# EasyEDA schematic TactJam_Assembly.json
TITLE: TactJam DevBoard; REV: 1.0; Date: 2020-11-18; Sheet: 1/1; Company: -
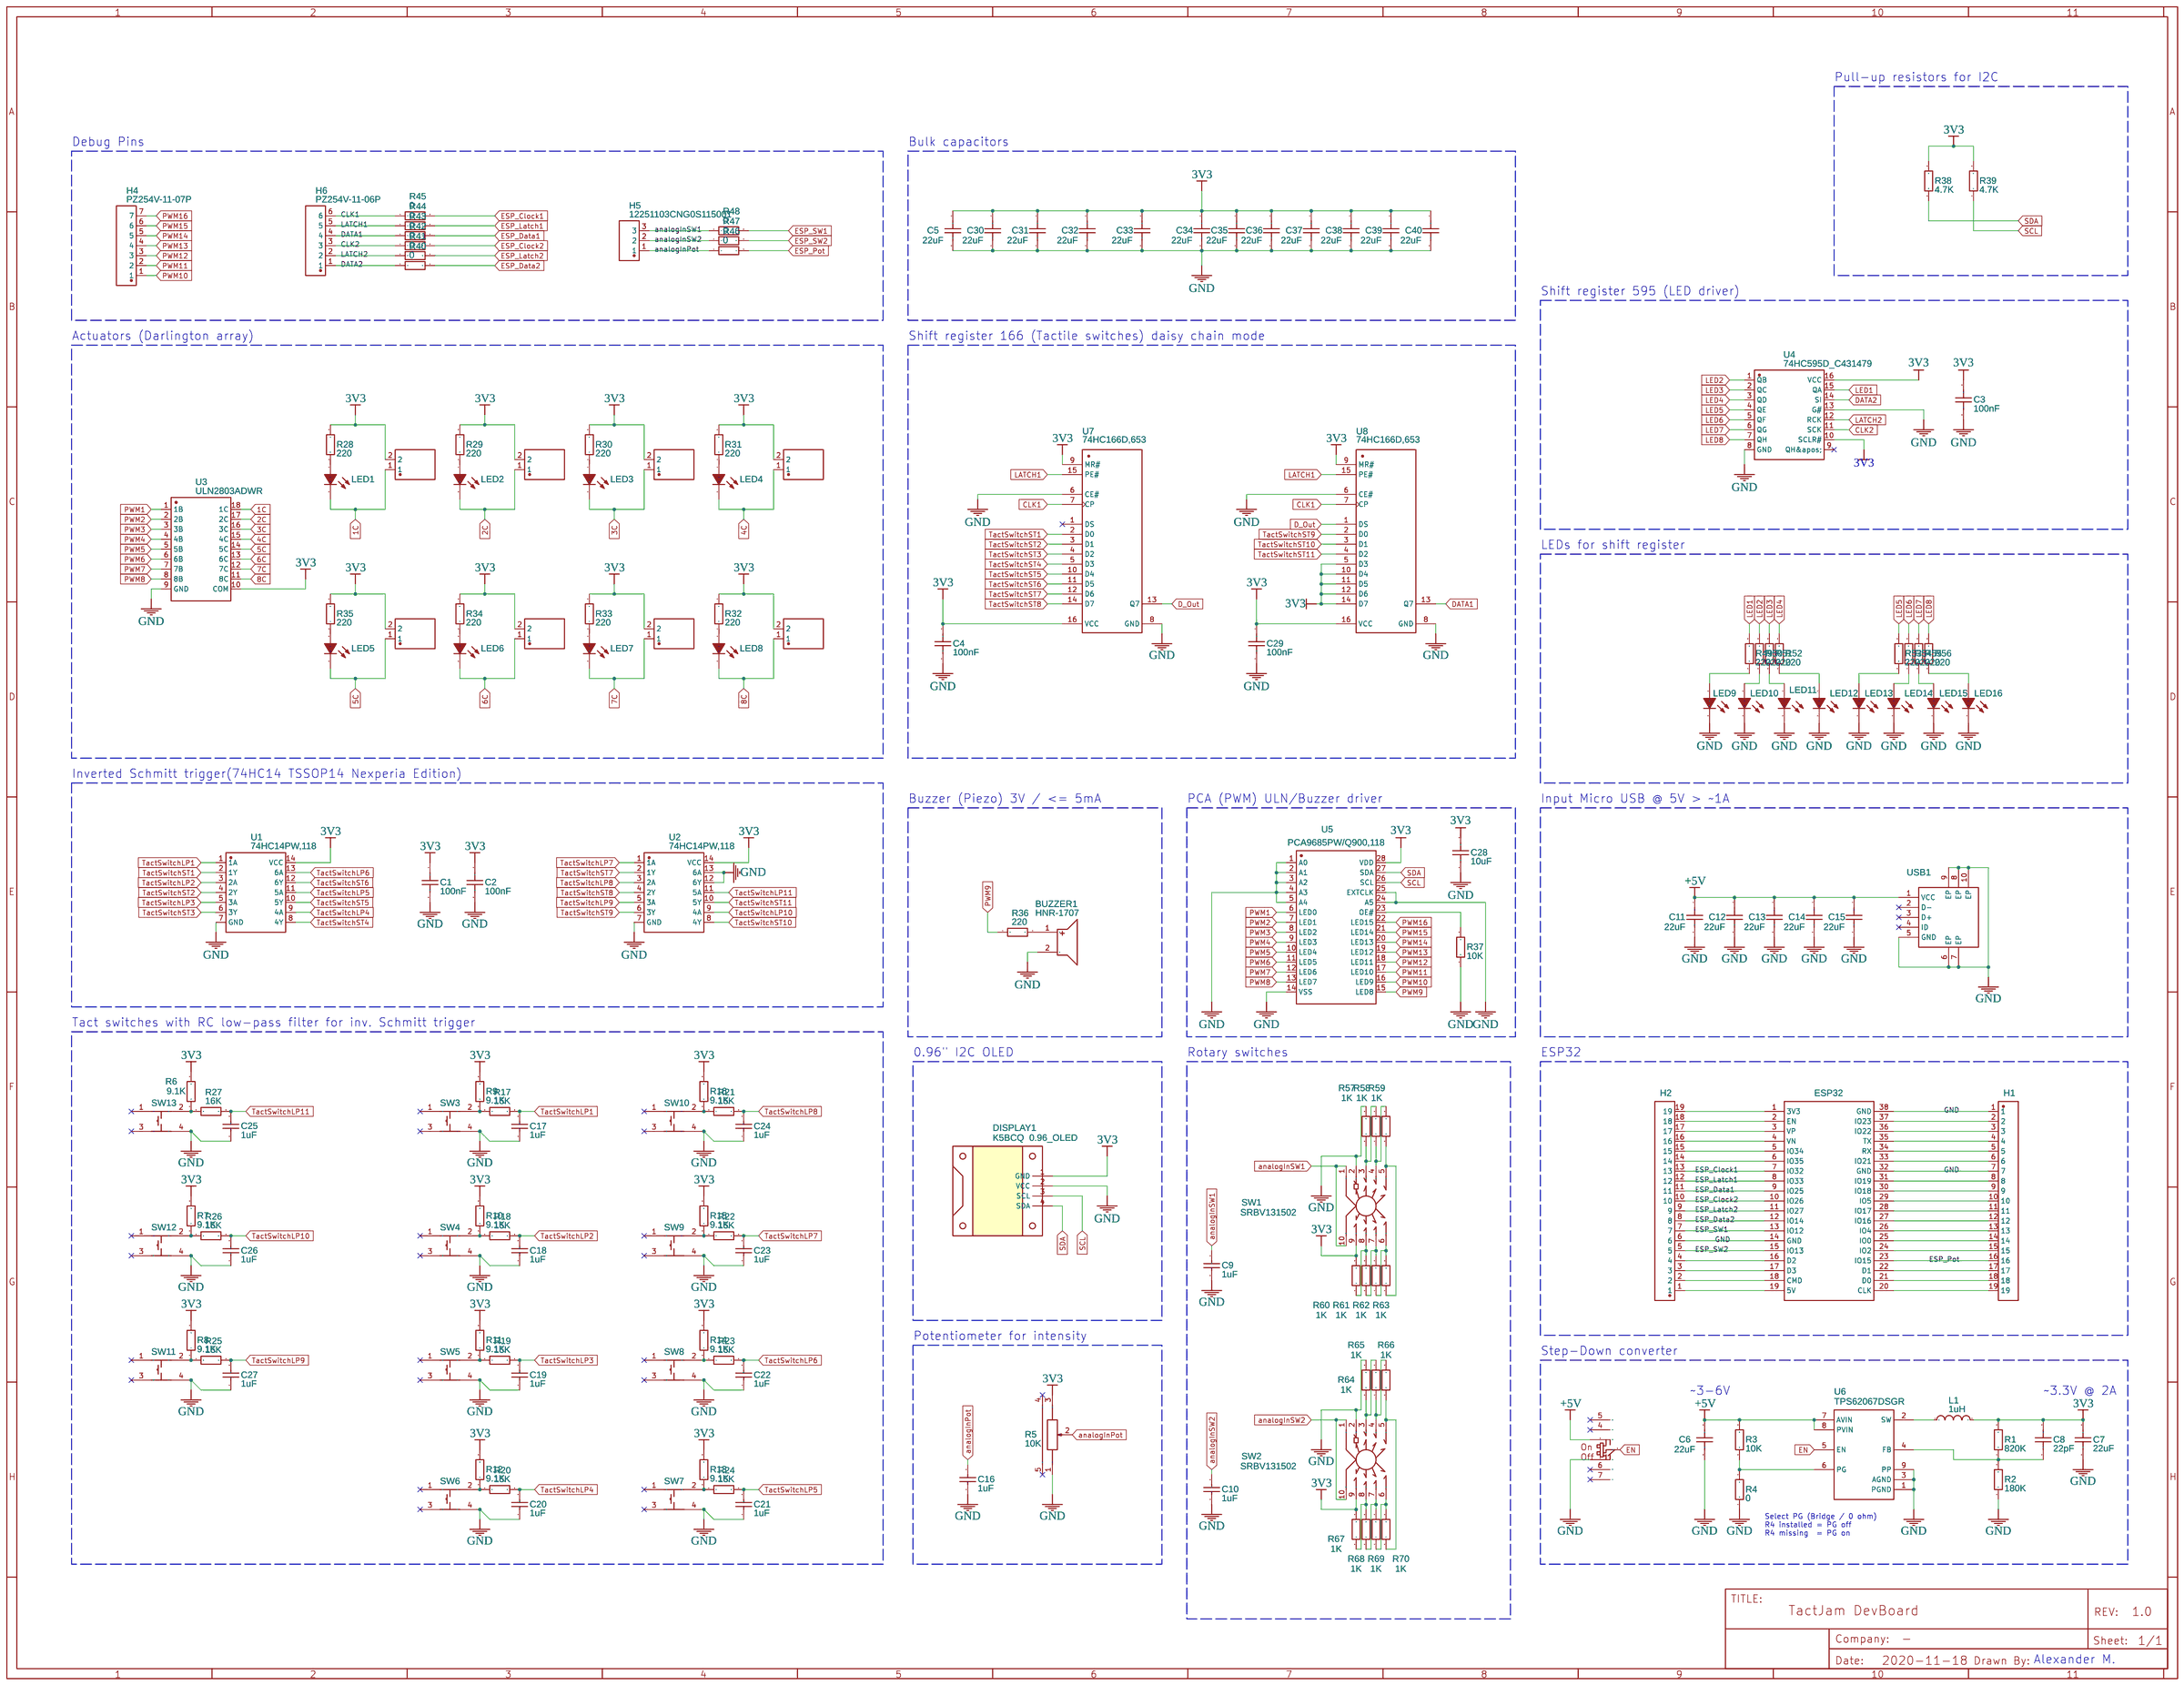
[diagram p0: schematic sheet]

## Parts
BUZZER1  HNR-1707  [BUZ-TH_BD17.0-P10.00-D0.9]
C1  100nF  [C0402]
C2  100nF  [C0402]
C3  100nF  [C0402]
C4  100nF  [C0402]
C5  22uF  [C0603]
C6  22uF  [C0603]
C7  22uF  [C0603]
C8  22pF  [C0402]
C9  1uF  [C0603]
C10  1uF  [C0603]
C11  22uF  [C0603]
C12  22uF  [C0603]
C13  22uF  [C0603]
C14  22uF  [C0603]
C15  22uF  [C0603]
C16  1uF  [C0603]
C17  1uF  [C0603]
C18  1uF  [C0603]
C19  1uF  [C0603]
C20  1uF  [C0603]
C21  1uF  [C0603]
C22  1uF  [C0603]
C23  1uF  [C0603]
C24  1uF  [C0603]
C25  1uF  [C0603]
C26  1uF  [C0603]
C27  1uF  [C0603]
C28  10uF  [C0603]
C29  100nF  [C0402]
C30  22uF  [C0603]
C31  22uF  [C0603]
C32  22uF  [C0603]
C33  22uF  [C0603]
C34  22uF  [C0603]
C35  22uF  [C0603]
C36  22uF  [C0603]
C37  22uF  [C0603]
C38  22uF  [C0603]
C39  22uF  [C0603]
C40  22uF  [C0603]
CONNECTOR1  Connector  [CONN-TH_2P-P2.54_2501S-2P]
CONNECTOR2  Connector  [CONN-TH_2P-P2.54_2501S-2P]
CONNECTOR3  Connector  [CONN-TH_2P-P2.54_2501S-2P]
CONNECTOR4  Connector  [CONN-TH_2P-P2.54_2501S-2P]
CONNECTOR5  Connector  [CONN-TH_2P-P2.54_2501S-2P]
CONNECTOR6  Connector  [CONN-TH_2P-P2.54_2501S-2P]
CONNECTOR7  Connector  [CONN-TH_2P-P2.54_2501S-2P]
CONNECTOR8  Connector  [CONN-TH_2P-P2.54_2501S-2P]
DISPLAY1  K5BCQ  0.96_OLED  [0.96 OLED]
ESP1  ESP32  [ESP32 MODULE]
H1  C247840  [HDR-TH_19P-P2.54-H-W10.5]
H2  C247840  [HDR-TH_19P-P2.54-H-W10.5]
H4  PZ254V-11-07P  [HDR-TH_7P-P2.54-V-M]
H5  12251103CNG0S115001  [HDR-TH_3P-P2.54-V]
H6  PZ254V-11-06P  [HDR-TH_6P-P2.54-V-M]
L1  1uH  [IND-SMD_L4.0-W4.0]
LED1  19-217/GHC-YR1S2/3T  [LED0603-R-RD]
LED2  19-217/GHC-YR1S2/3T  [LED0603-R-RD]
LED3  19-217/GHC-YR1S2/3T  [LED0603-R-RD]
LED4  19-217/GHC-YR1S2/3T  [LED0603-R-RD]
LED5  19-217/GHC-YR1S2/3T  [LED0603-R-RD]
LED6  19-217/GHC-YR1S2/3T  [LED0603-R-RD]
LED7  19-217/GHC-YR1S2/3T  [LED0603-R-RD]
LED8  19-217/GHC-YR1S2/3T  [LED0603-R-RD]
LED9  19-217/GHC-YR1S2/3T  [LED0603-R-RD]
LED10  19-217/GHC-YR1S2/3T  [LED0603-R-RD]
LED11  19-217/GHC-YR1S2/3T  [LED0603-R-RD]
LED12  19-217/GHC-YR1S2/3T  [LED0603-R-RD]
LED13  19-217/GHC-YR1S2/3T  [LED0603-R-RD]
LED14  19-217/GHC-YR1S2/3T  [LED0603-R-RD]
LED15  19-217/GHC-YR1S2/3T  [LED0603-R-RD]
LED16  19-217/GHC-YR1S2/3T  [LED0603-R-RD]
R1  820K  [R0603]
R2  180K  [R0603]
R3  10K  [R0603]
R4  0  [R0603]
R5  10K  [RES-TH_RK09K1130A5R]
R6  9.1K  [R0603]
R7  9.1K  [R0603]
R8  9.1K  [R0603]
R9  9.1K  [R0603]
R10  9.1K  [R0603]
R11  9.1K  [R0603]
R12  9.1K  [R0603]
R13  9.1K  [R0603]
R14  9.1K  [R0603]
R15  9.1K  [R0603]
R16  9.1K  [R0603]
R17  16K  [R0603]
R18  16K  [R0603]
R19  16K  [R0603]
R20  16K  [R0603]
R21  16K  [R0603]
R22  16K  [R0603]
R23  16K  [R0603]
R24  16K  [R0603]
R25  16K  [R0603]
R26  16K  [R0603]
R27  16K  [R0603]
R28  220  [R0603]
R29  220  [R0603]
R30  220  [R0603]
R31  220  [R0603]
R32  220  [R0603]
R33  220  [R0603]
R34  220  [R0603]
R35  220  [R0603]
R36  220  [R0603]
R37  10K  [R0603]
R38  4.7K  [R0603]
R39  4.7K  [R0603]
R40  0  [R0603]
R41  0  [R0603]
R42  0  [R0603]
R43  0  [R0603]
R44  0  [R0603]
R45  0  [R0603]
R46  0  [R0603]
R47  0  [R0603]
R48  0  [R0603]
R49  220  [R0603]
R50  220  [R0603]
R51  220  [R0603]
R52  220  [R0603]
R53  220  [R0603]
R54  220  [R0603]
R55  220  [R0603]
R56  220  [R0603]
R57  1K  [R0603]
R58  1K  [R0603]
R59  1K  [R0603]
R60  1K  [R0603]
R61  1K  [R0603]
R62  1K  [R0603]
R63  1K  [R0603]
R64  1K  [R0603]
R65  1K  [R0603]
R66  1K  [R0603]
R67  1K  [R0603]
R68  1K  [R0603]
R69  1K  [R0603]
R70  1K  [R0603]
SW1  SRBV131502  [SW-TH_SRBV131502]
SW2  SRBV131502  [SW-TH_SRBV131502]
SW3  TS-1003T-26  [SW-TH_4P-L12.0-W12.0-P5.00-LS12.5]
SW4  TS-1003T-26  [SW-TH_4P-L12.0-W12.0-P5.00-LS12.5]
SW5  TS-1003T-26  [SW-TH_4P-L12.0-W12.0-P5.00-LS12.5]
SW6  TS-1003T-26  [SW-TH_4P-L12.0-W12.0-P5.00-LS12.5]
SW7  TS-1003T-26  [SW-TH_4P-L12.0-W12.0-P5.00-LS12.5]
SW8  TS-1003T-26  [SW-TH_4P-L12.0-W12.0-P5.00-LS12.5]
SW9  TS-1003T-26  [SW-TH_4P-L12.0-W12.0-P5.00-LS12.5]
SW10  TS-1003T-26  [SW-TH_4P-L12.0-W12.0-P5.00-LS12.5]
SW11  TS-1003T-26  [SW-TH_4P-L12.0-W12.0-P5.00-LS12.5]
SW12  TS-1003T-26  [SW-TH_4P-L12.0-W12.0-P5.00-LS12.5]
SW13  TS-1003T-26  [SW-TH_4P-L12.0-W12.0-P5.00-LS12.5]
SWSTEP1  K3-1296S-E1  [SW-TH_K3-1296S-E1]
U1  74HC14PW,118  [TSSOP-14_L5.0-W4.4-P0.65-LS6.4-BL]
U2  74HC14PW,118  [TSSOP-14_L5.0-W4.4-P0.65-LS6.4-BL]
U3  ULN2803ADWR  [SOIC-18_L11.6-W7.5-P1.27-LS10.3-BL]
U4  74HC595D_C431479  [SOIC-16_L9.9-W3.9-P1.27-LS6.0-BL]
U5  PCA9685PW/Q900,118  [TSSOP-28_L9.7-W4.4-P0.65-LS6.4-BL]
U6  TPS62067DSGR  [WSON-8_L2.0-W2.0-P0.50-BL-EP_TPS259571DSGR]
U7  74HC166D,653  [SOIC-16_L10.8-W4.5-P1.27-LS6.8-BL]
U8  74HC166D,653  [SOIC-16_L10.8-W4.5-P1.27-LS6.8-BL]
USB1  105017-0001  [MICRO-USB-SMD_105017-0001]

## Library data of the parts
BUZZER1 = HNR-1707: Supplier: LCSC; Manufacturer: HNDZ; Contributor: LCSC; Supplier Part: C129400
C1-C4 C29 = CL05B104KB54PNC: Supplier: LCSC; Supplier Part: C307331; Manufacturer: Samsung Electro-Mechanics; Contributor: LCSC; LCSC Assembly: Yes; SMT Type: Extend
C5-C7 C11-C15 C30-C40 = CL10A226MQ8NRNC: Supplier: LCSC; Manufacturer: SAMSUNG; LCSC Assembly: Yes; Supplier Part: C59461; SMT Type: Basic
C8 = CL05C220JB5NNNC: Supplier: LCSC; Manufacturer: SAMSUNG; Supplier Part: C70464; LCSC Assembly: Yes; SMT Type: Extend
C9 C10 C16-C27 = CL10B105KA8NNNC: Supplier: LCSC; Manufacturer: SAMSUNG; Supplier Part: C29936; LCSC Assembly: Yes; SMT Type: Extend
C28 = CL10A106MA8NRNC: Supplier: LCSC; Manufacturer: SAMSUNG; Supplier Part: C96446; LCSC Assembly: Yes; SMT Type: Extend
CONNECTOR1 CONNECTOR3-CONNECTOR8 = 2501SB-2P: Supplier: LCSC; Supplier Part: C132463; Manufacturer: Shenzhen Cankemeng; Contributor: LCSC
CONNECTOR2 = 2501SB-2P: Supplier: LCSC; Supplier Part: C63855; Manufacturer: Shenzhen Cankemeng; Contributor: LCSC
DISPLAY1 = K5BCQ  0.96_OLED: Contributor: Kookavitch
ESP1 = ESP32: Contributor: changzi.LU
H1 H2 = C247840: Supplier: LCSC; Manufacturer: Boom Precision Elec; Contributor: LCSC
H4 = PZ254V-11-07P: Supplier: LCSC; Supplier Part: C492406; Manufacturer: XFCN; Contributor: LCSC
H5 = 12251103CNG0S115001: Supplier: LCSC; Supplier Part: C429954; Manufacturer: JILN; Contributor: LCSC
H6 = PZ254V-11-06P: Supplier: LCSC; Supplier Part: C492405; Manufacturer: XFCN; Contributor: LCSC
L1 = LQH44PN1R0NP0L: Supplier: LCSC; Manufacturer: MuRata; Supplier Part: C98026
LED1-LED16 = 19-217/GHC-YR1S2/3T: Supplier: LCSC; Manufacturer: EVERLIGHT; image: //image.lceda.cn/szlcsc/C72043.jpg; Supplier Part: C72043; SMT Type: Basic; JLCPCB SMD: Yes
R1 = TC0325B8203T5E: Supplier: LCSC; Manufacturer: UniOhm; Supplier Part: C53198; LCSC Assembly: Yes; SMT Type: Extend
R2 = 0603WAF1803T5E: Supplier: LCSC; Manufacturer: UniOhm; LCSC Assembly: Yes; Supplier Part: C22827; SMT Type: Basic
R3 R37 = 0603WAF1002T5E: Supplier: LCSC; Manufacturer: UniOhm; LCSC Assembly: Yes; Supplier Part: C25804; SMT Type: Basic
R4 R40-R48 = 0603WAF0000T5E: Supplier: LCSC; Manufacturer: UniOhm; Supplier Part: C21189; SMT Type: Basic; JLCPCB SMD: Yes
R5 = RK09K1130A5R: Supplier: LCSC; Supplier Part: C209779; Manufacturer: ALPS Electric; Contributor: LCSC
R6-R16 = TC0350D9101T5E: Supplier: LCSC; Manufacturer: UniOhm; Supplier Part: C98730; LCSC Assembly: Yes; SMT Type: Extend
R17-R27 = TC0325B1602T5E: Supplier: LCSC; Manufacturer: UniOhm; Contributor: LCSC; Supplier Part: C139125; LCSC Assembly: Yes; SMT Type: Extend
R28-R36 R49-R56 = 0603WAF2200T5E: Supplier: LCSC; Manufacturer: UniOhm; Supplier Part: C22962; SMT Type: Basic; JLCPCB SMD: Yes
R38 R39 = 0603WAF4701T5E: Supplier: LCSC; Manufacturer: UniOhm; Supplier Part: C23162; SMT Type: Basic; JLCPCB SMD: Yes
R57-R70 = 0603WAF1001T5E: Supplier: LCSC; Manufacturer: UniOhm; Supplier Part: C21190; SMT Type: Basic; JLCPCB SMD: Yes
SW1 SW2 = SRBV131502: Supplier: LCSC; Supplier Part: C255511; Manufacturer: ALPS Electric; Contributor: LCSC
SW3-SW13 = TS-1003T-26: Supplier: LCSC; Supplier Part: C455235; Manufacturer: XUNPU; Contributor: LCSC
SWSTEP1 = K3-1296S-E1: Supplier: LCSC; Manufacturer: HRO; Contributor: LCSC; Supplier Part: C128955
U1 U2 = 74HC14PW,118: Supplier: LCSC; Manufacturer: Nexperia; image: //image.lceda.cn/szlcsc/C5606.jpg; Supplier Part: C5606; LCSC Assembly: Yes; SMT Type: Extend
U3 = ULN2803ADWR: Supplier: LCSC; Manufacturer: TI; LCSC Assembly: Yes; image: //image.lceda.cn/szlcsc/C9683.jpg; Supplier Part: C9683; SMT Type: Basic
U4 = 74HC595D_C431479: Supplier: LCSC; Supplier Part: C431479; Manufacturer: TOSHIBA; Manufacturer Part: 74HC595D; Contributor: LCSC; LCSC Assembly: Yes; SMT Type: Extend
U5 = PCA9685PW/Q900,118: Supplier: LCSC; Manufacturer: NXP; Supplier Part: C92206; LCSC Assembly: Yes; SMT Type: Extend
U6 = TPS62067DSGR: Supplier: LCSC; Manufacturer: TI; image: //image.lceda.cn/szlcsc/C7098.jpg; Supplier Part: C7098; LCSC Assembly: Yes; SMT Type: Extend
U7 U8 = 74HC166D,653: Supplier: LCSC; Manufacturer: Nexperia; Supplier Part: C131891; LCSC Assembly: Yes; SMT Type: Extend
USB1 = 105017-0001: Supplier: LCSC; Manufacturer: MOLEX; Contributor: LCSC; Supplier Part: C136000

## Nets
3V3: C1.1 C2.1 C3.1 C4.1 C5.1 C7.2 C8.2 C28.2 C29.1 C30.1 C31.1 C32.1 C33.1 C34.1 C35.1 C36.1 C37.1 C38.1 C39.1 C40.1 CONNECTOR1.2 CONNECTOR2.2 CONNECTOR3.2 CONNECTOR4.2 CONNECTOR5.2 CONNECTOR6.2 CONNECTOR7.2 CONNECTOR8.2 DISPLAY1.1(GND) L1.2 R1.2 R5.3 R6.2 R7.2 R8.2 R9.2 R10.2 R11.2 R12.2 R13.2 R14.2 R15.2 R16.2 R28.2 R29.2 R30.2 R31.2 R32.2 R33.2 R34.2 R35.2 R38.2 R39.2 R60.2 R67.2 SW1.9 SW2.9 U1.14(VCC) U2.14(VCC) U3.10(COM) U4.10(SCLR#) U4.16(VCC) U5.28(VDD) U7.9(MR#) U7.16(VCC) U8.5(D3) U8.9(MR#) U8.10(D4) U8.11(D5) U8.12(D6) U8.14(D7) U8.16(VCC)
+5V: C6.1 C11.1 C12.1 C13.1 C14.1 C15.1 R3.2 SWSTEP1.3 U6.7(AVIN) U6.8(PVIN) USB1.1(VCC)
GND: BUZZER1.2 C1.2 C2.2 C3.2 C4.2 C5.2 C6.2 C7.1 C9.1 C10.1 C11.2 C12.2 C13.2 C14.2 C15.2 C16.1 C17.1 C18.1 C19.1 C20.1 C21.1 C22.1 C23.1 C24.1 C25.1 C26.1 C27.1 C28.1 C29.2 C30.2 C31.2 C32.2 C33.2 C34.2 C35.2 C36.2 C37.2 C38.2 C39.2 C40.2 DISPLAY1.2(VCC) ESP1.14(GND) ESP1.32(GND) ESP1.38(GND) H1.1 H1.7 H2.6 LED9.2(C) LED10.2(C) LED11.2(C) LED12.2(C) LED13.2(C) LED14.2(C) LED15.2(C) LED16.2(C) R2.1 R4.1 R5.1 R37.1 R57.2 R64.2 SW1.2 SW2.2 SW3.4 SW4.4 SW5.4 SW6.4 SW7.4 SW8.4 SW9.4 SW10.4 SW11.4 SW12.4 SW13.4 SWSTEP1.1 U1.7(GND) U2.7(GND) U2.12(6Y) U2.13(6A) U3.9(GND) U4.8(GND) U4.13(G#) U5.1(A0) U5.2(A1) U5.3(A2) U5.4(A3) U5.5(A4) U5.14(VSS) U5.24(A5) U5.25(EXTCLK) U6.1(PGND) U6.3(AGND) U6.9(PP) U7.6(CE#) U7.8(GND) U8.6(CE#) U8.8(GND) USB1.5(GND) USB1.6(EP) USB1.7(EP) USB1.8(EP) USB1.9(EP) USB1.10(EP)
1C: CONNECTOR1.1 LED1.2(C) U3.18(1C)
2C: CONNECTOR2.1 LED2.2(C) U3.17(2C)
3C: CONNECTOR3.1 LED3.2(C) U3.16(3C)
4C: CONNECTOR4.1 LED4.2(C) U3.15(4C)
5C: CONNECTOR5.1 LED5.2(C) U3.14(5C)
6C: CONNECTOR6.1 LED6.2(C) U3.13(6C)
7C: CONNECTOR7.1 LED7.2(C) U3.12(7C)
8C: CONNECTOR8.1 LED8.2(C) U3.11(8C)
analogInPot: C16.2 H5.1 R5.2 R46.1
analogInSW1: C9.2 H5.3 R48.1 SW1.1 SW1.10
analogInSW2: C10.2 H5.2 R47.1 SW2.1 SW2.10
CLK1: H6.6 R45.1 U7.7(CP) U8.7(CP)
CLK2: H6.3 R42.1 U4.11(SCK)
D_Out: U7.13(Q7) U8.1(DS)
DATA1: H6.4 R43.1 U8.13(Q7)
DATA2: H6.1 R40.1 U4.14(SI)
EN: SWSTEP1.2 U6.5(EN)
ESP_Clock1: ESP1.7(IO32) H2.13 R45.2
ESP_Clock2: ESP1.10(IO26) H2.10 R42.2
ESP_Data1: ESP1.9(IO25) H2.11 R43.2
ESP_Data2: ESP1.12(IO14) H2.8 R40.2
ESP_Latch1: ESP1.8(IO33) H2.12 R44.2
ESP_Latch2: ESP1.11(IO27) H2.9 R41.2
ESP_Pot: ESP1.23(IO15) H1.16 R46.2
ESP_SW1: ESP1.13(IO12) H2.7 R48.2
ESP_SW2: ESP1.15(IO13) H2.5 R47.2
LATCH1: H6.5 R44.1 U7.15(PE#) U8.15(PE#)
LATCH2: H6.2 R41.1 U4.12(RCK)
LED1: R49.2 U4.15(QA)
LED2: R50.2 U4.1(QB)
LED3: R51.2 U4.2(QC)
LED4: R52.2 U4.3(QD)
LED5: R53.2 U4.4(QE)
LED6: R54.2 U4.5(QF)
LED7: R55.2 U4.6(QG)
LED8: R56.2 U4.7(QH)
PWM1: U3.1(1B) U5.6(LED0)
PWM2: U3.2(2B) U5.7(LED1)
PWM3: U3.3(3B) U5.8(LED2)
PWM4: U3.4(4B) U5.9(LED3)
PWM5: U3.5(5B) U5.10(LED4)
PWM6: U3.6(6B) U5.11(LED5)
PWM7: U3.7(7B) U5.12(LED6)
PWM8: U3.8(8B) U5.13(LED7)
PWM9: R36.1 U5.15(LED8)
PWM10: H4.1 U5.16(LED9)
PWM11: H4.2 U5.17(LED10)
PWM12: H4.3 U5.18(LED11)
PWM13: H4.4 U5.19(LED12)
PWM14: H4.5 U5.20(LED13)
PWM15: H4.6 U5.21(LED14)
PWM16: H4.7 U5.22(LED15)
SCL: DISPLAY1.3(SCL) R39.1 U5.26(SCL)
SDA: DISPLAY1.4(SDA) R38.1 U5.27(SDA)
TactSwitchLP1: C17.2 R17.2 U1.1(1A)
TactSwitchLP2: C18.2 R18.2 U1.3(2A)
TactSwitchLP3: C19.2 R19.2 U1.5(3A)
TactSwitchLP4: C20.2 R20.2 U1.9(4A)
TactSwitchLP5: C21.2 R24.2 U1.11(5A)
TactSwitchLP6: C22.2 R23.2 U1.13(6A)
TactSwitchLP7: C23.2 R22.2 U2.1(1A)
TactSwitchLP8: C24.2 R21.2 U2.3(2A)
TactSwitchLP9: C27.2 R25.2 U2.5(3A)
TactSwitchLP10: C26.2 R26.2 U2.9(4A)
TactSwitchLP11: C25.2 R27.2 U2.11(5A)
TactSwitchST1: U1.2(1Y) U7.2(D0)
TactSwitchST2: U1.4(2Y) U7.3(D1)
TactSwitchST3: U1.6(3Y) U7.4(D2)
TactSwitchST4: U1.8(4Y) U7.5(D3)
TactSwitchST5: U1.10(5Y) U7.10(D4)
TactSwitchST6: U1.12(6Y) U7.11(D5)
TactSwitchST7: U2.2(1Y) U7.12(D6)
TactSwitchST8: U2.4(2Y) U7.14(D7)
TactSwitchST9: U2.6(3Y) U8.2(D0)
TactSwitchST10: U2.8(4Y) U8.3(D1)
TactSwitchST11: U2.10(5Y) U8.4(D2)
Net-(BUZZER1-1): BUZZER1.1 R36.2
Net-(C8-1): C8.1 R1.1 R2.2 U6.4(FB)
Net-(ESP1-1): ESP1.1(3V3) H2.19
Net-(ESP1-2): ESP1.2(EN) H2.18
Net-(ESP1-3): ESP1.3(VP) H2.17
Net-(ESP1-4): ESP1.4(VN) H2.16
Net-(ESP1-5): ESP1.5(IO34) H2.15
Net-(ESP1-6): ESP1.6(IO35) H2.14
Net-(ESP1-16): ESP1.16(D2) H2.4
Net-(ESP1-17): ESP1.17(D3) H2.3
Net-(ESP1-18): ESP1.18(CMD) H2.2
Net-(ESP1-19): ESP1.19(5V) H2.1
Net-(ESP1-20): ESP1.20(CLK) H1.19
Net-(ESP1-21): ESP1.21(D0) H1.18
Net-(ESP1-22): ESP1.22(D1) H1.17
Net-(ESP1-24): ESP1.24(IO2) H1.15
Net-(ESP1-25): ESP1.25(IO0) H1.14
Net-(ESP1-26): ESP1.26(IO4) H1.13
Net-(ESP1-27): ESP1.27(IO16) H1.12
Net-(ESP1-28): ESP1.28(IO17) H1.11
Net-(ESP1-29): ESP1.29(IO5) H1.10
Net-(ESP1-30): ESP1.30(IO18) H1.9
Net-(ESP1-31): ESP1.31(IO19) H1.8
Net-(ESP1-33): ESP1.33(IO21) H1.6
Net-(ESP1-34): ESP1.34(RX) H1.5
Net-(ESP1-35): ESP1.35(TX) H1.4
Net-(ESP1-36): ESP1.36(IO22) H1.3
Net-(ESP1-37): ESP1.37(IO23) H1.2
Net-(L1-1): L1.1 U6.2(SW)
Net-(LED1-1): LED1.1(A) R28.1
Net-(LED2-1): LED2.1(A) R29.1
Net-(LED3-1): LED3.1(A) R30.1
Net-(LED4-1): LED4.1(A) R31.1
Net-(LED5-1): LED5.1(A) R35.1
Net-(LED6-1): LED6.1(A) R34.1
Net-(LED7-1): LED7.1(A) R33.1
Net-(LED8-1): LED8.1(A) R32.1
Net-(LED9-1): LED9.1(A) R49.1
Net-(LED10-1): LED10.1(A) R50.1
Net-(LED11-1): LED11.1(A) R51.1
Net-(LED12-1): LED12.1(A) R52.1
Net-(LED13-1): LED13.1(A) R53.1
Net-(LED14-1): LED14.1(A) R54.1
Net-(LED15-1): LED15.1(A) R55.1
Net-(LED16-1): LED16.1(A) R56.1
Net-(R3-1): R3.1 R4.2 U6.6(PG)
Net-(R6-1): R6.1 R27.1 SW13.2
Net-(R7-1): R7.1 R26.1 SW12.2
Net-(R8-1): R8.1 R25.1 SW11.2
Net-(R9-1): R9.1 R17.1 SW3.2
Net-(R10-1): R10.1 R18.1 SW4.2
Net-(R11-1): R11.1 R19.1 SW5.2
Net-(R12-1): R12.1 R20.1 SW6.2
Net-(R13-1): R13.1 R24.1 SW7.2
Net-(R14-1): R14.1 R23.1 SW8.2
Net-(R15-1): R15.1 R22.1 SW9.2
Net-(R16-1): R16.1 R21.1 SW10.2
Net-(R37-2): R37.2 U5.23(OE#)
Net-(R57-1): R57.1 R58.2 SW1.3
Net-(R58-1): R58.1 R59.2 SW1.4
Net-(R59-1): R59.1 R63.1 SW1.5
Net-(R60-1): R60.1 R61.2 SW1.8
Net-(R61-1): R61.1 R62.2 SW1.7
Net-(R62-1): R62.1 R63.2 SW1.6
Net-(R64-1): R64.1 R65.2 SW2.3
Net-(R65-1): R65.1 R66.2 SW2.4
Net-(R66-1): R66.1 R70.1 SW2.5
Net-(R67-1): R67.1 R68.2 SW2.8
Net-(R68-1): R68.1 R69.2 SW2.7
Net-(R69-1): R69.1 R70.2 SW2.6

Not connected (* = marked no-connect by the designer): R5 4(EH)* 5(EH)*; SW3 1* 3*; SW4 1* 3*; SW5 1* 3*; SW6 1* 3*; SW7 1* 3*; SW8 1* 3*; SW9 1* 3*; SW10 1* 3*; SW11 1* 3*; SW12 1* 3*; SW13 1* 3*; SWSTEP1 4* 5* 6* 7*; U4 9(QH')*; U7 1(DS)*; USB1 2(D-)* 3(D+)* 4(ID)*

## Notes on the sheet
- Pull-up resistors for I2C
- Debug Pins
- Bulk capacitors
- Shift register 595 (LED driver)
- Actuators (Darlington array)
- Shift register 166 (Tactile switches) daisy chain mode
- LEDs for shift register
- Inverted Schmitt trigger(74HC14 TSSOP14 Nexperia Edition)
- Buzzer (Piezo) 3V / <= 5mA
- PCA (PWM) ULN/Buzzer driver
- Input Micro USB @ 5V > ~1A
- Tact switches with RC low-pass filter for inv. Schmitt trigger
- 0.96" I2C OLED
- Rotary switches
- ESP32
- Potentiometer for intensity
- Step-Down converter
- ~3-6V
- ~3.3V @ 2A
- Select PG (Bridge / 0 ohm)
  R4 installed = PG off
  R4 missing  = PG on
- Alexander M.
